# EAGLE design CzujnikParametrowMuru-1.0 (EAGLE 7.1.0)
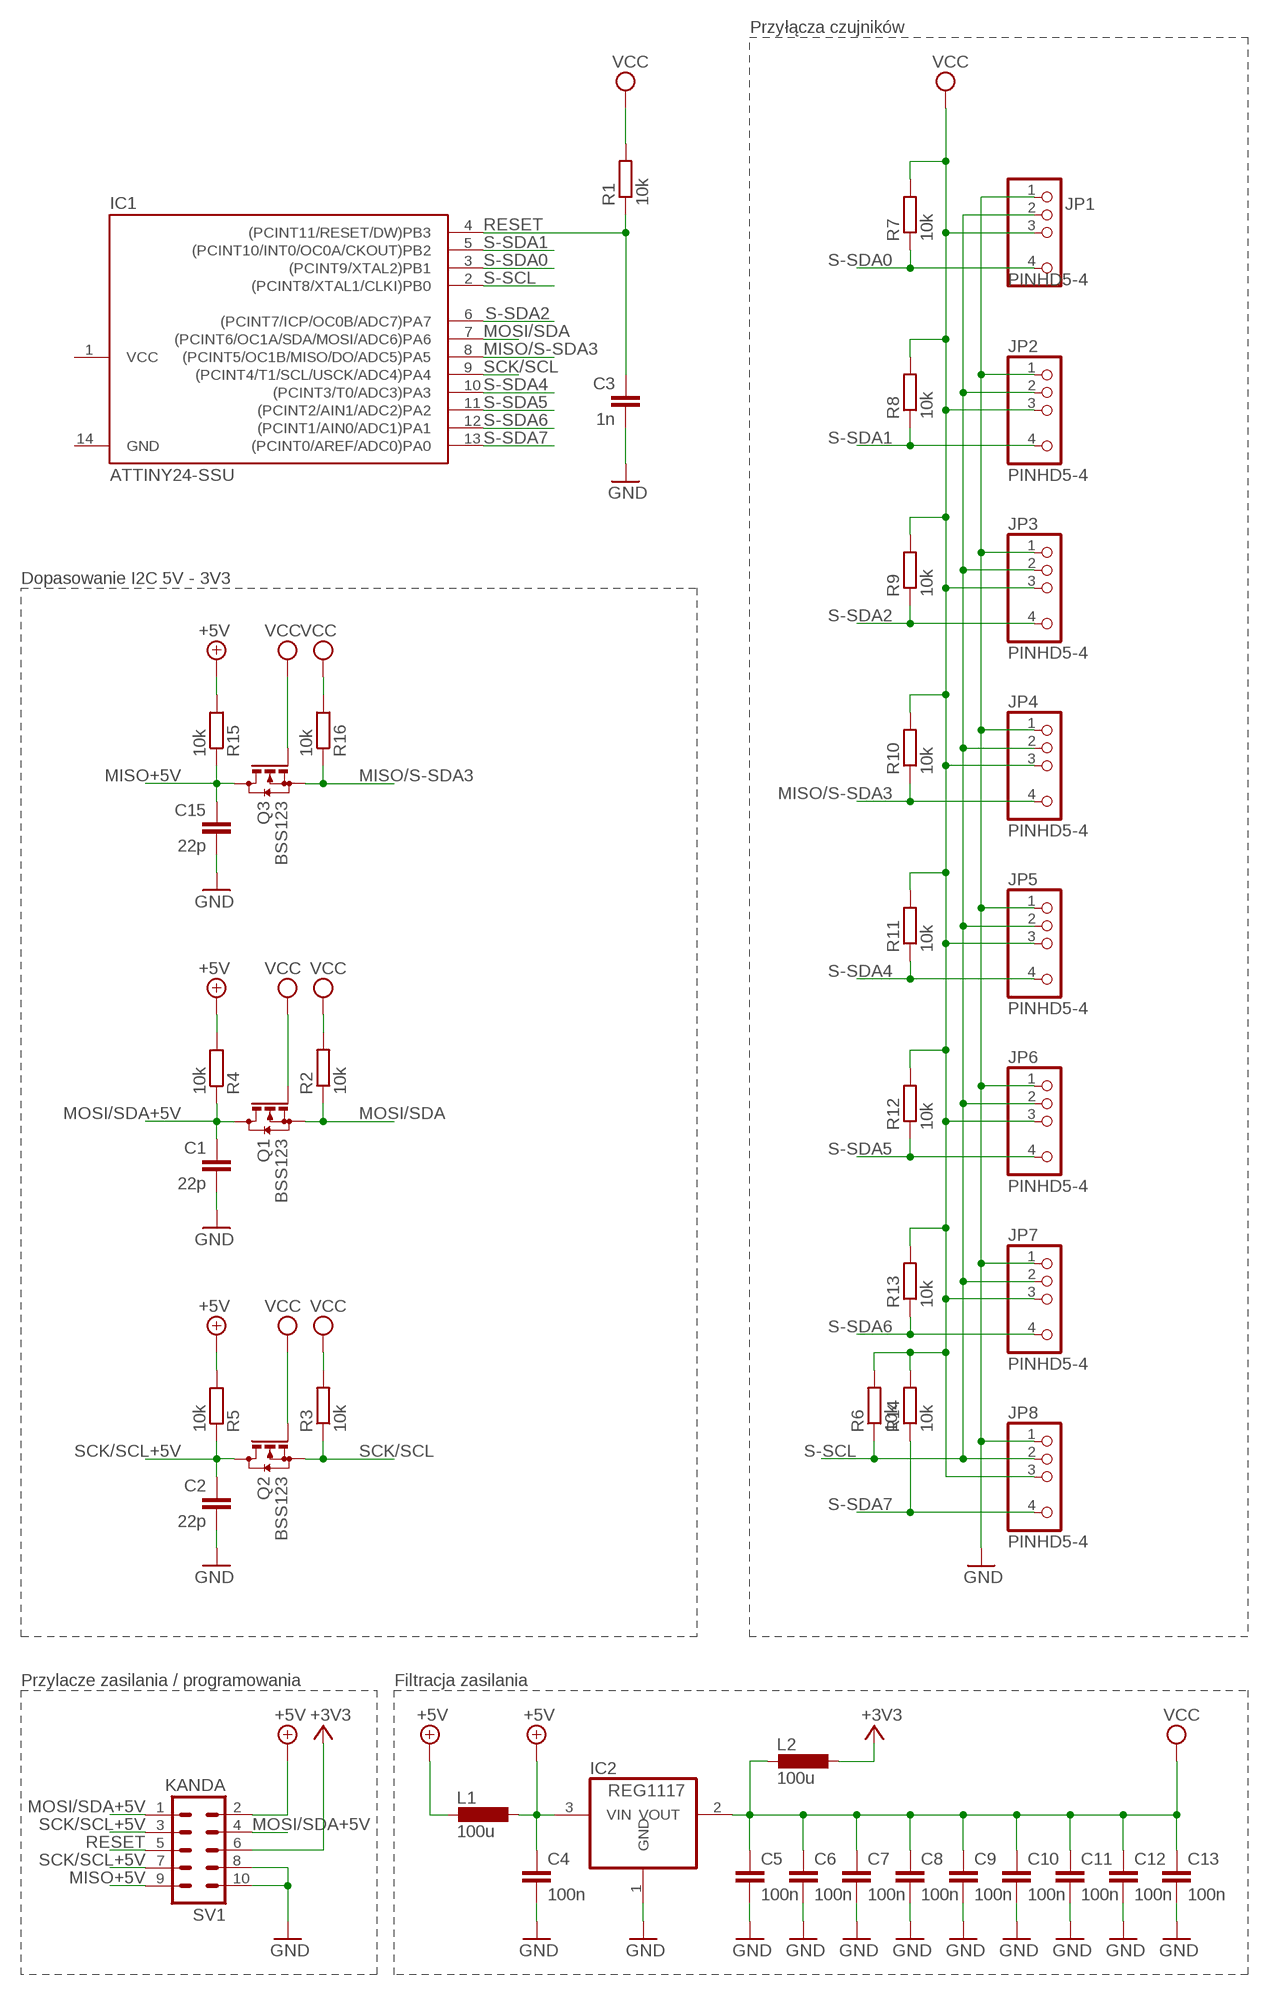
[diagram p0: schematic, sheet 1]

## Parts
C1  22p  C-EUC1206  [C1206]
C2  22p  C-EUC1206  [C1206]
C3  1n  C-EUC1206  [C1206]
C4  100n  C-EUC1206  [C1206]
C5  100n  C-EUC1206  [C1206]
C6  100n  C-EUC1206  [C1206]
C7  100n  C-EUC1206  [C1206]
C8  100n  C-EUC1206  [C1206]
C9  100n  C-EUC1206  [C1206]
C10  100n  C-EUC1206  [C1206]
C11  100n  C-EUC1206  [C1206]
C12  100n  C-EUC1206  [C1206]
C13  100n  C-EUC1206  [C1206]
C15  22p  C-EUC1206  [C1206]
IC1  ATTINY24-SSU  ATTINY24/44/84-SSU  [SOIC14]
IC2  REG1117  [SOT223]
JP1  PINHD5-4  [1X5-4]
JP2  PINHD5-4  [1X5-4]
JP3  PINHD5-4  [1X5-4]
JP4  PINHD5-4  [1X5-4]
JP5  PINHD5-4  [1X5-4]
JP6  PINHD5-4  [1X5-4]
JP7  PINHD5-4  [1X5-4]
JP8  PINHD5-4  [1X5-4]
L1  100u  L-EUL1210  [R1210]
L2  100u  L-EUL1210  [R1210]
Q1  BSS123  [SOT23]
Q2  BSS123  [SOT23]
Q3  BSS123  [SOT23]
R1  10k  R-EU_R1206  [R1206]
R2  10k  R-EU_R1206  [R1206]
R3  10k  R-EU_R1206  [R1206]
R4  10k  R-EU_R1206  [R1206]
R5  10k  R-EU_R1206  [R1206]
R6  10k  R-EU_R1206  [R1206]
R7  10k  R-EU_R1206  [R1206]
R8  10k  R-EU_R1206  [R1206]
R9  10k  R-EU_R1206  [R1206]
R10  10k  R-EU_R1206  [R1206]
R11  10k  R-EU_R1206  [R1206]
R12  10k  R-EU_R1206  [R1206]
R13  10k  R-EU_R1206  [R1206]
R14  10k  R-EU_R1206  [R1206]
R15  10k  R-EU_R1206  [R1206]
R16  10k  R-EU_R1206  [R1206]
SV1  KANDA  ML10L  [ML10L]

## Nets
+3V3: L2.1 SV1.6
+5V: C4.1 IC2.3(VIN) L1.1 R4.2 R5.2 R15.2
+5V_W: L1.2 SV1.2 ; supply symbol labelled +5V
GND: C1.2 C2.2 C3.2 C4.2 C5.2 C6.2 C7.2 C8.2 C9.2 C10.2 C11.2 C12.2 C13.2 C15.2 IC2.1(GND) JP1.1 JP2.1 JP3.1 JP4.1 JP5.1 JP6.1 JP7.1 JP8.1 SV1.8 SV1.10
MISO+5V: C15.1 Q3.3(D) R15.1 SV1.9
MISO/S-SDA3: IC1.8((PCINT5/OC1B/MISO/DO/ADC5)PA5) JP4.4 Q3.2(S) R10.1 R16.1
MOSI/SDA: IC1.7((PCINT6/OC1A/SDA/MOSI/ADC6)PA6) Q1.2(S) R2.1
MOSI/SDA+5V: C1.1 Q1.3(D) R4.1 SV1.1 SV1.4
RESET: C3.1 IC1.4((PCINT11/RESET/DW)PB3) R1.1 SV1.5
S-SCL: IC1.2((PCINT8/XTAL1/CLKI)PB0) JP1.2 JP2.2 JP3.2 JP4.2 JP5.2 JP6.2 JP7.2 JP8.2 R6.1
S-SDA0: IC1.3((PCINT9/XTAL2)PB1) JP1.4 R7.1
S-SDA1: IC1.5((PCINT10/INT0/OC0A/CKOUT)PB2) JP2.4 R8.1
S-SDA2: IC1.6((PCINT7/ICP/OC0B/ADC7)PA7) JP3.4 R9.1
S-SDA4: IC1.10((PCINT3/T0/ADC3)PA3) JP5.4 R11.1
S-SDA5: IC1.11((PCINT2/AIN1/ADC2)PA2) JP6.4 R12.1
S-SDA6: IC1.12((PCINT1/AIN0/ADC1)PA1) JP7.4 R13.1
S-SDA7: IC1.13((PCINT0/AREF/ADC0)PA0) JP8.4 R14.1
SCK/SCL: IC1.9((PCINT4/T1/SCL/USCK/ADC4)PA4) Q2.2(S) R3.1
SCK/SCL+5V: C2.1 Q2.3(D) R5.1 SV1.3 SV1.7
VCC: C5.1 C6.1 C7.1 C8.1 C9.1 C10.1 C11.1 C12.1 C13.1 IC2.2(VOUT) JP1.3 JP2.3 JP3.3 JP4.3 JP5.3 JP6.3 JP7.3 JP8.3 L2.2 Q1.1(G) Q2.1(G) Q3.1(G) R1.2 R2.2 R3.2 R6.2 R7.2 R8.2 R9.2 R10.2 R11.2 R12.2 R13.2 R14.2 R16.2

## Notes on the sheet
- Przyłącza czujników
- Dopasowanie I2C 5V - 3V3
- Przylacze zasilania / programowania | Filtracja zasilania

## Power pins joined to a net without a drawn wire
GND: IC1.14(GND)
VCC: IC1.1(VCC)

## Library data of the parts
C1-C13 C15 = rcl:C-EU: CAPACITOR, European symbol
IC1 = attiny24_44_84:ATTINY24/44/84
IC2 = burr-brown:REG1117: 800mA and 1A Low Dropout (LDO) Positive Regulator 1.8V, 2.5V, 2.85V, 3.3V, 5V, and Adj; MPN: REG1117; OC_FARNELL: 1097566; OC_NEWARK: 14P6981
JP1-JP8 = RD:PINHD5-4
L1 L2 = rcl:L-EU: INDUCTOR, European symbol
Q1-Q3 = transistor-small-signal:BSS123: N-CHANNEL MOS FET
R1-R16 = rcl:R-EU_: RESISTOR, European symbol
SV1 = con-harting-ml:ML10: HARTING; OC_FARNELL: unknown; OC_NEWARK: unknown

## Net classes
0 default: clearance 0.355 mm

## Board
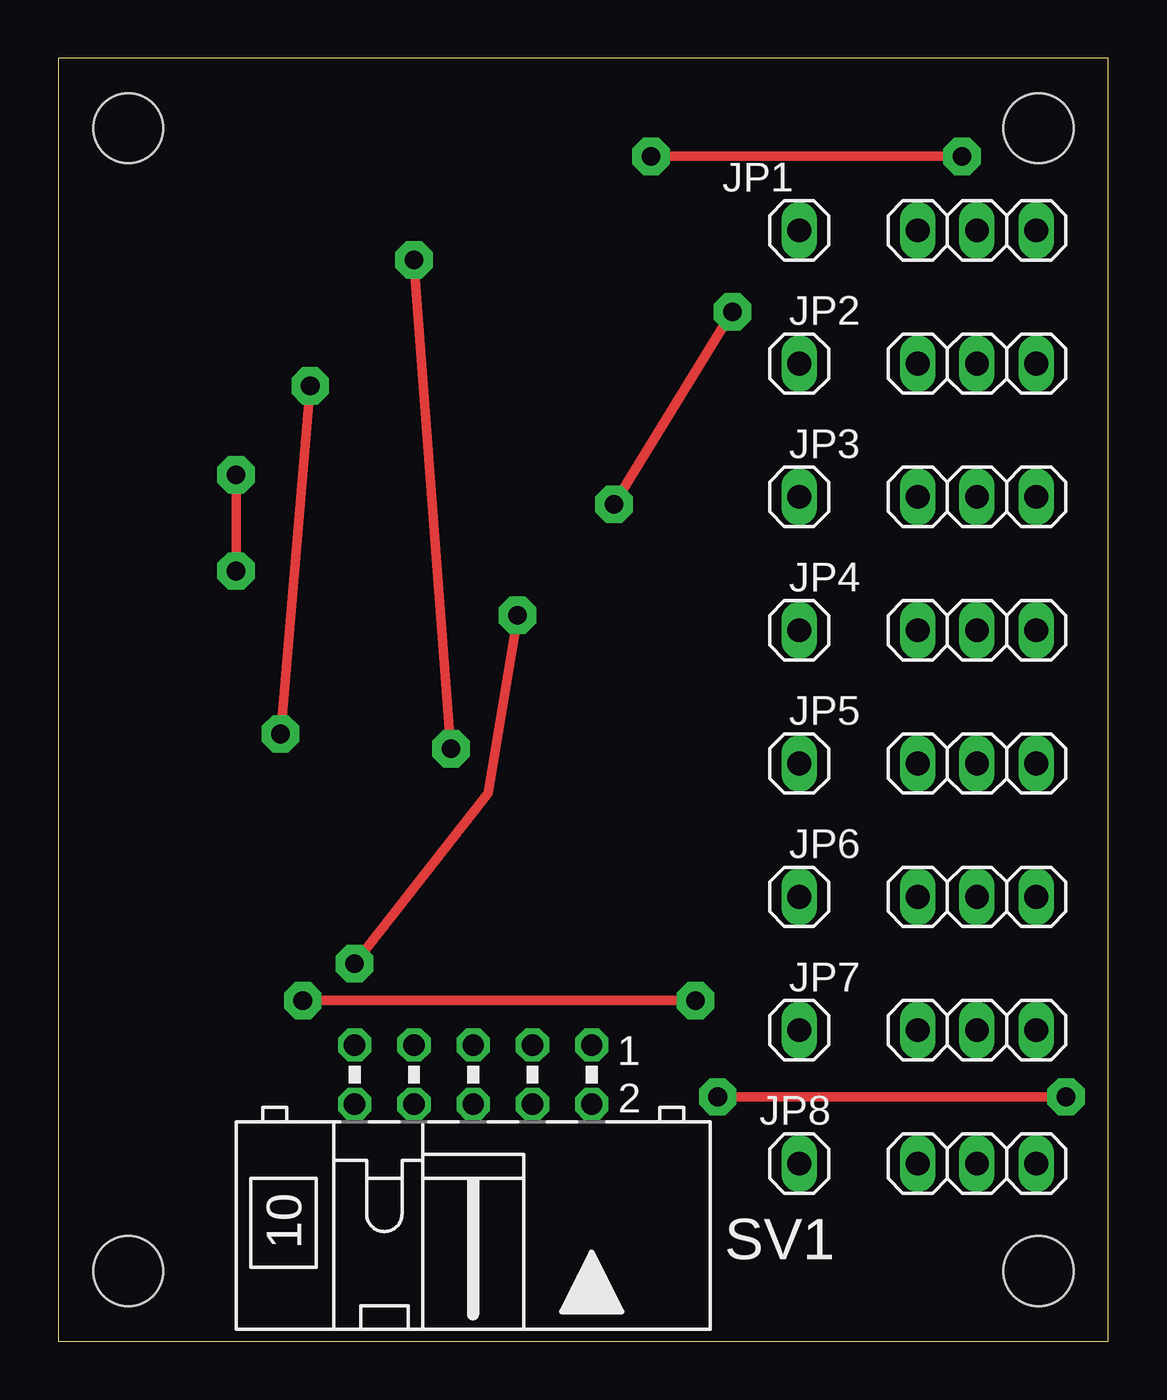
[diagram p1: board, top side]
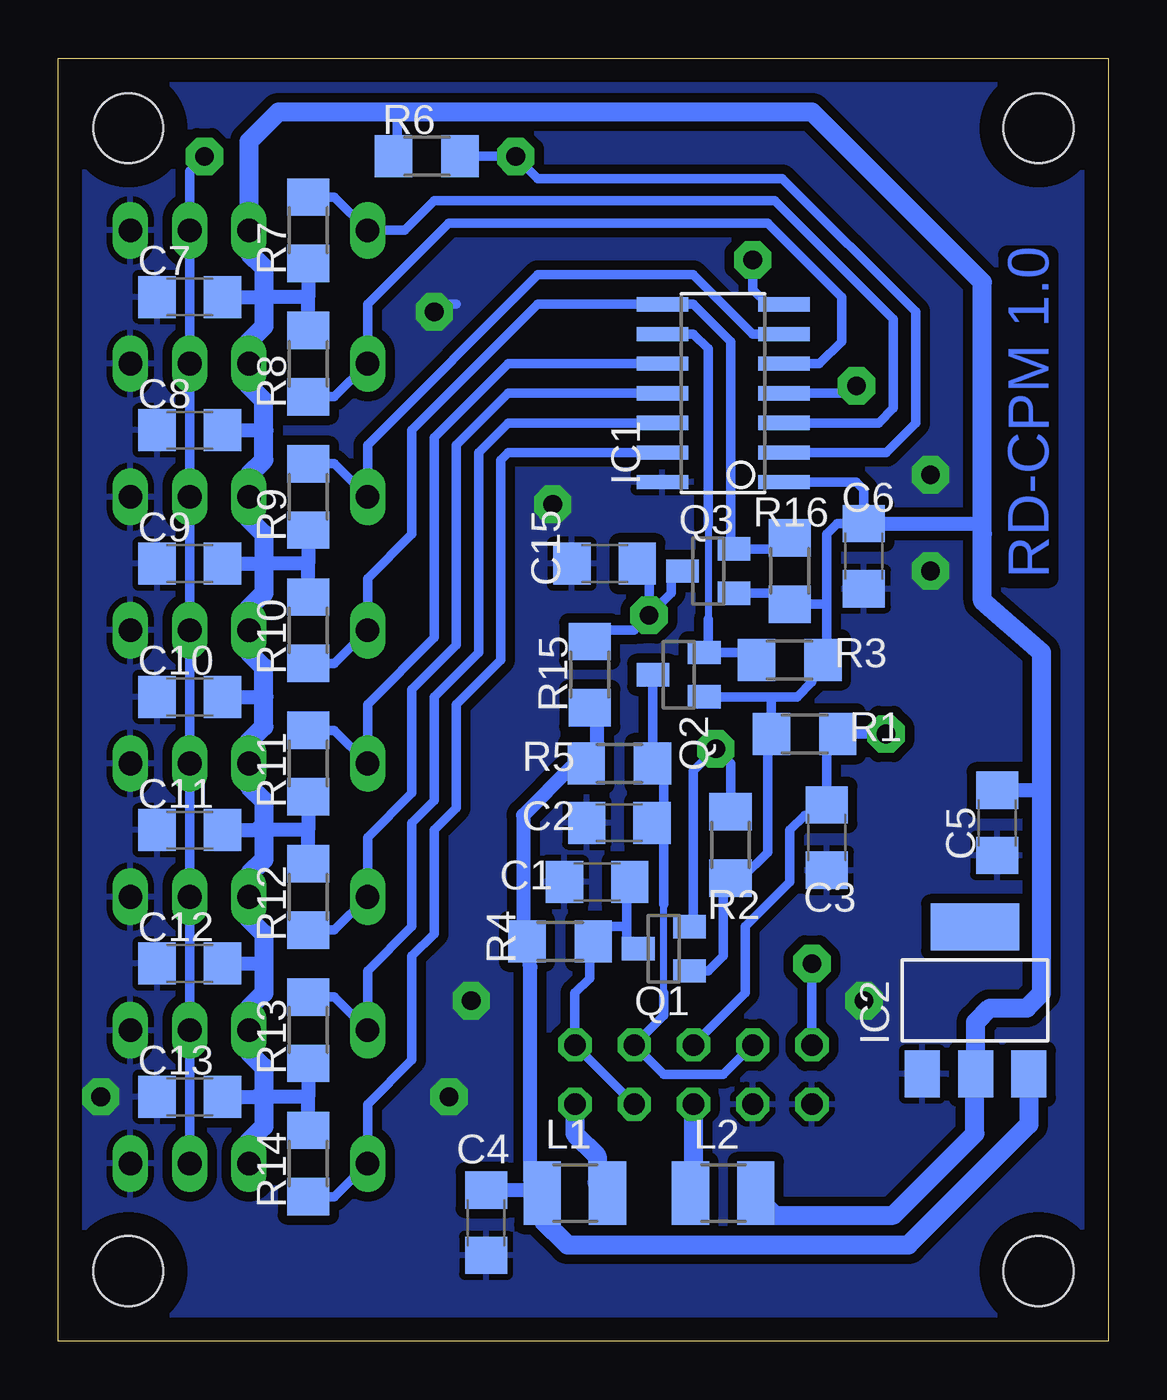
[diagram p2: board, bottom side, seen from below]

Size 45 x 55 mm. Coordinates in mm from the lower left corner, seen from the top.
Outline: 0,0 45,0 45,55 0,55 0,0
Copper layers (1*16): Top 0.035mm / dielectric 1.5mm / Bottom 0.035mm
Design rules "default *": minimum track width 10mil, minimum drill 24mil, track to track 8mil, track to pad 8mil, pad to pad 8mil, via to via 8mil, smd to smd 8mil, copper to edge 40mil, drill to drill 8mil, minimum pad ring 10mil, minimum via ring 8mil, stop-mask expansion 4mil, vias tented up to drill 0mil, thermal gap 10mil
Holes 3 mm at 3,3 3,52 42,52 42,3

### Footprints (pad centres in the part's own frame; a part is rotated, then mirrored left to right if it is on the bottom)
C1206 = smd 1.6 x 1.8: 1 -1.4,0; 2 1.4,0
SOIC14 = smd 0.61 x 2.21: 1 -3.81,-2.603; 2 -2.54,-2.603; 3 -1.27,-2.603; 4 0,-2.603; 5 1.27,-2.603; 6 2.54,-2.603; 7 3.81,-2.603; 8 3.81,2.603; 9 2.54,2.603; 10 1.27,2.603; 11 0,2.603; 12 -1.27,2.603; 13 -2.54,2.603; 14 -3.81,2.603
SOT223 = smd 1.499 x 2.007: 1 -2.261,-3.15; 2 0.025,-3.15; 3 2.311,-3.15 | smd 3.81 x 2.007: 4 0,3.15
1X5-4 = drill 1.016 long: 1 -5.08,0; 2 -2.54,0; 3 0,0; 4 5.08,0
R1210 = smd 1.6 x 2.7: 1 -1.4,0; 2 1.4,0
SOT23 = smd 1 x 1.4: 1 -0.95,-1.1; 2 0.95,-1.1; 3 0,1.1
R1206 = smd 1.6 x 1.803: 1 -1.422,0; 2 1.422,0
ML10L = drill 0.914 octagon: 1 -5.08,-1.27; 2 -5.08,1.27; 3 -2.54,-1.27; 4 -2.54,1.27; 5 0,-1.27; 6 0,1.27; 7 2.54,-1.27; 8 2.54,1.27; 9 5.08,-1.27; 10 5.08,1.27

### Placement (x,y rotation side)
C1  21.91,19.68 180 bottom
C2  20.95,22.23 180 bottom
C3  12.06,21.59 270 bottom
C4  26.67,5.08 270 bottom
C5  4.76,22.23 270 bottom
C6  10.48,33.66 270 bottom
C7  39.37,44.77 180 bottom
C8  39.37,39.05 180 bottom
C9  39.37,33.34 180 bottom
C10  39.37,27.62 180 bottom
C11  39.37,21.91 180 bottom
C12  39.37,16.19 180 bottom
C13  39.37,10.48 180 bottom
C15  21.59,33.34 180 bottom
IC1  16.51,40.64 90 bottom
IC2  5.71,14.61 0 bottom
JP1  36.83,47.62 180 top
JP2  36.83,41.91 180 top
JP3  36.83,36.2 180 top
JP4  36.83,30.48 180 top
JP5  36.83,24.77 180 top
JP6  36.83,19.05 180 top
JP7  36.83,13.34 180 top
JP8  36.83,7.62 180 top
L1  22.86,6.35 0 bottom
L2  16.51,6.35 0 bottom
Q1  19.05,16.83 90 bottom
Q2  18.41,28.57 90 bottom
Q3  17.14,33.02 90 bottom
R1  13.02,26.04 180 bottom
R2  16.19,21.27 270 bottom
R3  13.65,29.21 0 bottom
R4  23.5,17.14 180 bottom
R5  20.95,24.77 180 bottom
R6  29.21,50.8 180 bottom
R7  34.29,47.62 270 bottom
R8  34.29,41.91 90 bottom
R9  34.29,36.2 270 bottom
R10  34.29,30.48 90 bottom
R11  34.29,24.77 270 bottom
R12  34.29,19.05 90 bottom
R13  34.29,13.34 270 bottom
R14  34.29,7.62 90 bottom
R15  22.23,28.57 270 bottom
R16  13.65,33.02 270 bottom
SV1  17.78,11.43 180 top

### Tracks (layer width: path | path; a pad name or v marks a point on that pad's centre or on a via)
+3V3
  Bottom 0.813: SV1.6 17.78,6.48 L2.1
+5V
  Bottom 0.61: R15.2 21.91,26.84 21.91,24.77 R5.2 23.01,24.61 25.08,22.54 25.08,17.31 R4.2 24.77,16.03 24.77,6.86 L1.1 24.39,6.48 C4.1
  Bottom 0.813: L1.1 24.26,5.21 23.18,4.13 8.57,4.13 3.4,9.3 IC2.3
+5V_W
  Bottom 0.813: SV1.2 22.86,8.89 21.91,7.94 21.91,6.8 L1.2
GND  (via drill 0.8)
  Top 0.406: v7.62,37.15 v7.62,33.02 | v43.18,10.48 v28.26,10.48 | v28.89,44.13 v23.81,35.88 | v27.3,14.61 v10.48,14.61
  Bottom 0.406: 27.94,44.45 28.26,44.45 28.89,43.81
  pour Bottom (isolate 0.406, rank 6): -1.27,55.88 -1.27,-1.27 45.72,-1.27 45.72,55.88
MISO+5V  (via drill 0.8)
  Top 0.406: v12.7,16.19 18.41,23.5 v19.68,31.11
  Bottom 0.406: SV1.9 v12.7,16.19 | v19.68,31.11 18.73,32.07 18.73,33.02 Q3.3 | v19.68,31.11 20.32,30.48 21.74,30.48 R15.1 | v19.68,31.11 19.68,33.15 C15.1
MISO/S-SDA3
  Bottom 0.406: R16.1 14.12,33.97 Q3.2 16.19,34.12 16.19,42.86 17.78,44.45 IC1.8 24.45,44.45 29.84,39.05 29.84,34.61 31.75,32.7 JP4.4 | R10.1 33.17,29.06 JP4.4 | JP4.4 31.75,31.75
MOSI/SDA  (via drill 0.8)
  Top 0.406: v16.83,25.4 v15.24,46.35
  Bottom 0.406: v15.24,46.35 15.24,45.09 14.61,44.45 IC1.7 | Q1.2 17.78,17.78 17.78,24.45 v16.83,25.4 16.19,24.77 R2.1
MOSI/SDA+5V
  Bottom 0.406: SV1.4 SV1.1 22.86,14.92 22.23,15.56 22.23,16.99 R4.1 21.76,17.78 20.64,17.78 | C1.1 20.64,19.68 20.64,17.78 | 20.64,17.78 20.64,16.83 Q1.3
RESET  (via drill 0.8)
  Top 0.406: v9.53,26.04 v10.79,40.96
  Bottom 0.406: v10.79,40.96 11.11,40.64 IC1.4 | R1.1 11.6,25.87 | SV1.5 15.56,14.92 15.56,17.78 13.65,19.68 13.65,21.91 13.02,22.54 12.51,22.54 C3.1 12.06,25.57 R1.1 | v9.53,26.04 R1.1
S-SCL  (via drill 0.8)
  Top 0.406: v38.73,50.8 v25.4,50.8
  Bottom 0.406: JP8.2 JP7.2 JP6.2 JP5.2 JP4.2 JP3.2 JP2.2 JP1.2 39.37,50.16 v38.73,50.8 | IC1.2 9.53,38.1 8.26,39.37 8.26,44.13 13.97,49.85 24.45,49.85 v25.4,50.8 R6.1
S-SDA0
  Bottom 0.406: R7.1 33.17,49.05 JP1.4 30.16,47.62 28.89,48.9 14.29,48.9 9.21,43.81 9.21,40.01 9.84,39.37 IC1.3
S-SDA1
  Bottom 0.406: R8.1 33.17,40.49 JP2.4 31.75,44.45 28.26,47.94 14.61,47.94 11.43,44.77 11.43,42.86 12.38,41.91 IC1.5
S-SDA2
  Bottom 0.406: R9.1 33.17,37.62 JP3.4 31.75,38.42 24.45,45.72 17.78,45.72 15.24,43.18 IC1.6
S-SDA4
  Bottom 0.406: IC1.10 25.72,41.91 28.89,38.73 28.89,30.16 31.75,27.3 JP5.4 33.17,26.19 R11.1
S-SDA5
  Bottom 0.406: R12.1 33.17,17.63 JP6.4 31.75,21.59 29.84,23.5 29.84,27.94 27.94,29.84 27.94,38.42 25.72,40.64 IC1.11
S-SDA6
  Bottom 0.406: R13.1 33.17,14.76 JP7.4 31.75,15.88 29.84,17.78 29.84,22.23 28.89,23.18 28.89,27.62 26.99,29.53 26.99,38.1 25.72,39.37 IC1.12
S-SDA7
  Bottom 0.406: R14.1 33.17,6.2 JP8.4 31.75,10.16 29.84,12.06 29.84,16.51 28.89,17.46 28.89,21.91 27.94,22.86 27.94,27.3 26.04,29.21 26.04,37.78 25.72,38.1 IC1.13
SCK/SCL
  Bottom 0.305: 17.14,34.92 17.14,30.96
  Bottom 0.406: R3.1 14.76,29.52 Q2.2 17.14,29.7 17.14,30.96 | 17.14,34.92 17.14,42.55 17.78,43.18 IC1.9
SCK/SCL+5V
  Bottom 0.305: 19.05,14.92 19.05,18.73
  Bottom 0.406: SV1.7 16.51,11.43 19.05,11.43 SV1.3 19.05,13.97 19.05,14.92 | 19.05,18.73 19.05,22.23 | 19.05,22.23 19.05,24.13 20,24.93 R5.1 19.52,25.42 Q2.3 | C2.1 19.05,22.23
VCC
  Bottom 0.406: Q3.1 13.65,32.07 R16.2 12.06,31.6 | 12.06,31.6 12.06,29.53 R3.2 12.7,28.74 12.7,28.26 13.33,27.62 14.29,27.62 | 12.06,31.6 12.06,34.61 11.62,35.05 C6.1 10.48,36.51 10.79,36.83 IC1.1 | Q2.1 14.29,27.62 | 14.29,27.62 14.44,27.47 R1.2 14.61,25.87 14.61,20.95 15.71,19.85 R2.2 16.51,19.53 16.51,16.51 17.14,15.88 Q1.1 | R6.2 30.48,51.12 30.48,52.7
  Bottom 0.61: C13.1 36.51,10.48 36.2,10.79 | R13.2 34.29,10.48 | 34.29,10.48 36.2,10.48 | R14.2 34.29,10.48 | C12.1 36.2,16.19 | C11.1 36.51,21.91 36.2,22.23 | R11.2 34.29,21.91 | 34.29,21.91 36.2,21.91 | R12.2 34.29,21.91 | C10.1 36.2,27.62 | C9.1 36.2,33.34 34.29,33.34 | R9.2 34.29,33.34 | R10.2 34.29,33.34 | C8.1 36.2,39.05 | C7.1 36.2,44.77 34.29,44.77 | R7.2 34.29,44.77 | R8.2 34.29,44.77 | C6.1 5.4,35.05 5.4,34.61 | C5.1 2.86,23.62 2.86,23.5
  Bottom 0.813: JP8.3 36.83,8.57 36.2,9.21 36.2,10.48 36.2,10.79 36.2,11.75 36.83,12.38 JP7.3 36.83,14.29 36.2,14.92 36.2,16.19 36.2,17.46 36.83,18.1 JP6.3 36.83,20 36.2,20.64 36.2,21.91 36.2,22.23 36.2,23.18 36.83,23.81 JP5.3 36.83,25.72 36.2,26.35 36.2,27.62 36.2,28.89 36.83,29.53 JP4.3 36.83,31.43 36.2,32.07 36.2,33.34 36.2,34.61 36.83,35.24 JP3.3 36.83,37.15 36.2,37.78 36.2,39.05 36.2,40.32 36.83,40.96 JP2.3 36.83,42.86 36.2,43.5 36.2,44.77 36.2,46.04 36.83,46.67 JP1.3 36.83,51.44 35.56,52.7 30.48,52.7 12.7,52.7 5.4,45.4 5.4,34.61 5.4,31.75 2.86,29.53 2.86,23.5 2.86,14.92 3.49,14.29 5.08,14.29 5.69,13.68 IC2.2 5.71,11.43 5.71,8.89 9.21,5.4 14.29,5.4 15.11,6.22 L2.2

### Text on the board
Bottom: RD-CPM 1.0